# EAGLE schematic Plugv1 (EAGLE 7.5.0)
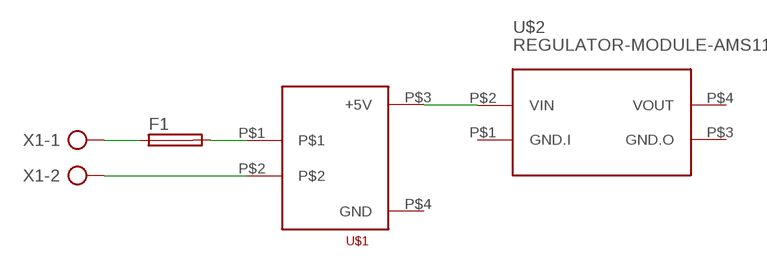
[diagram p0: schematic, sheet 1]

## Parts
F1  SH22,5A  [SH22,5A]
U$1  HLK-PM01  [HLK-PM01]
U$2  REGULATOR-MODULE-AMS1117  [REGULATOR-MODULE-AMS1117]
X1  AK500/2-H  [AK500/2-H]

## Nets
N$1: U$1.P$3(+5V)
N$3: F1.2 U$1.P$1
N$4: F1.1 X1.1
N$5: U$1.P$2 X1.2
Unconnected: U$1.P$4(GND) U$2.P$1(GND.I) U$2.P$2(VIN) U$2.P$3(GND.O) U$2.P$4(VOUT)

## Library data of the parts
F1 = fuse:SH22,5A: FUSE HOLDER grid 22,5mm, isolated cap OGN0031 8201, Schurter (Buerklin); MPN: 0031.7701.11; OC_FARNELL: unknown; OC_NEWARK: 04F1224
U$1 = HLK-PM01:HLK-PM01
U$2 = Regulator-Module-AMS1117-5to3V:REGULATOR-MODULE-AMS1117
X1 = con-ptr500:AK500/2-H: CONNECTOR Aug. 2004 / PTR Meßtechnik: Die Bezeichnung der Serie AK505 wurde geändert. Es handelt sich hierbei um AK500 in horizontaler Ausführung.; OC_FARNELL: unknown; OC_NEWARK: unknown